# Altium schematic sheet Alim.SchDoc
size A4
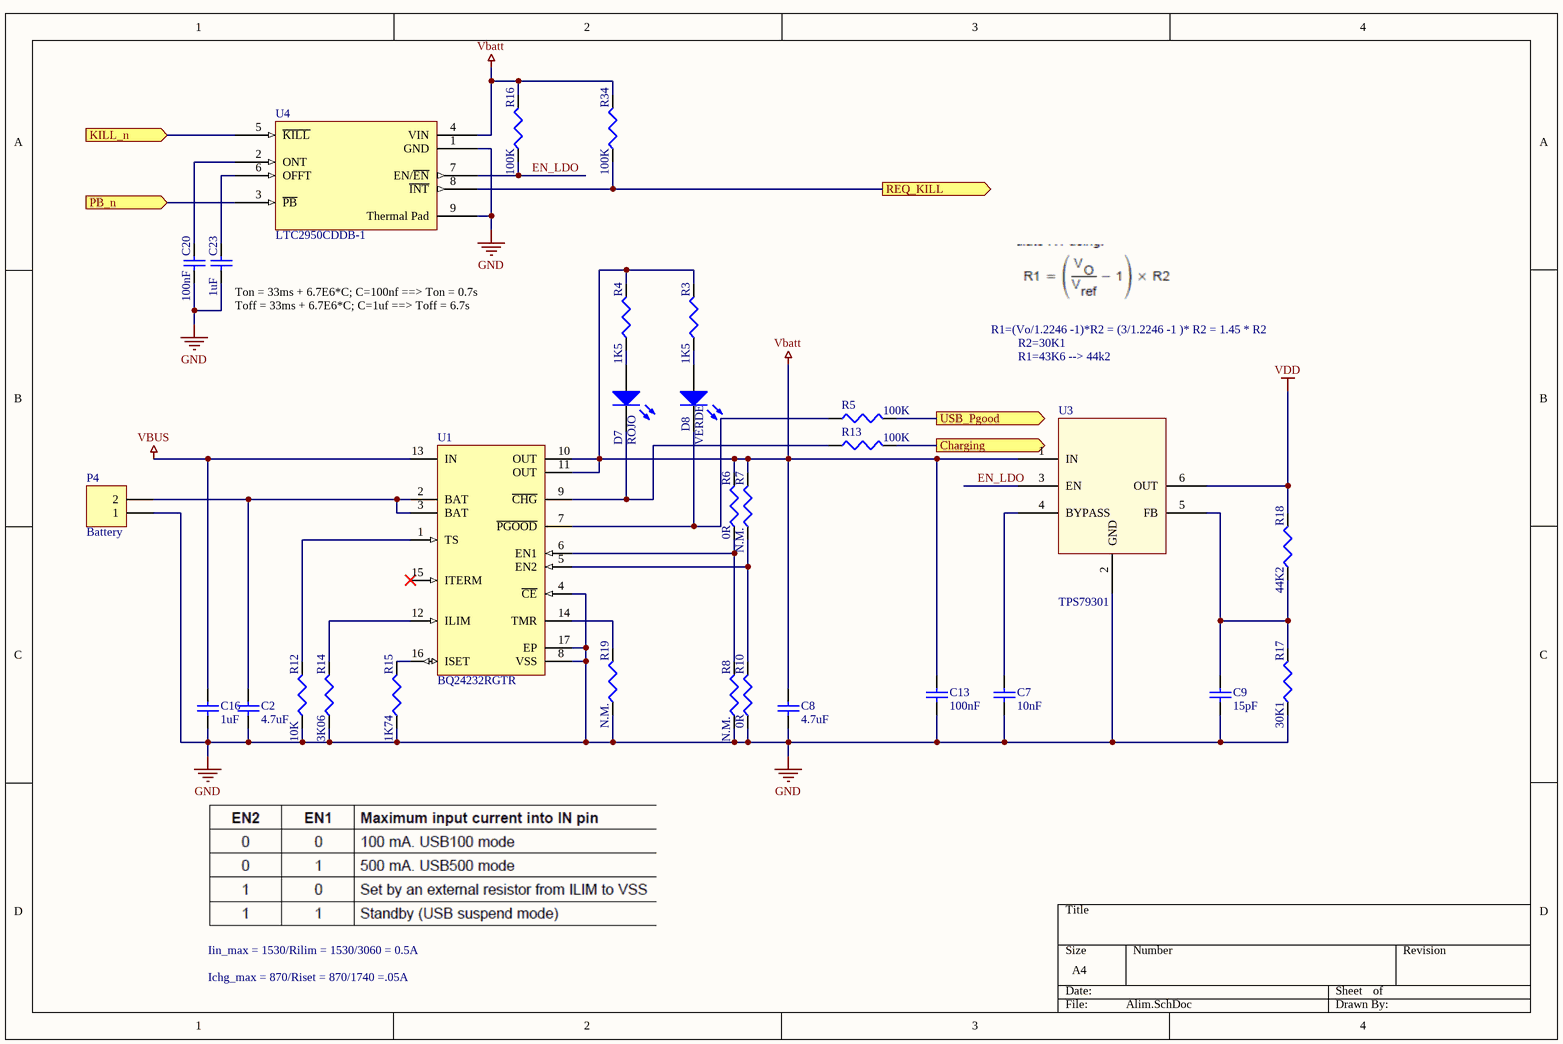
[diagram p0: Alim.SchDoc]

## Parts
C2  value 4.7uF  [C0805]  (hidden comment: Cap)
C7  value 10nF  [0402]  (hidden comment: Cap)
C8  value 4.7uF  [C0805]  (hidden comment: Cap)
C9  value 15pF  [0402]  (hidden comment: Cap)
C13  value 100nF  [0402]  (hidden comment: Cap)
C16  value 1uF  [C0805]  (hidden comment: Cap)
C20  value 100nF  [0402]  (hidden comment: Cap)
C23  value 1uF  [C0805]  (hidden comment: Cap)
D7  ROJO  [led_0805]
D8  VERDE  [led_0805]
P4  Battery  [MOLEX_5268-2]
R3  value 1K5  [J1-0603]  (hidden comment: Res3)
R4  value 1K5  [J1-0603]  (hidden comment: Res3)
R5  value 100K  [J1-0603]  (hidden comment: Res3)
R6  value 0R  [J1-0603]  (hidden comment: Res3)
R7  value N.M.  [J1-0603]  (hidden comment: Res3)
R8  value N.M.  [J1-0603]  (hidden comment: Res3)
R10  value 0R  [J1-0603]  (hidden comment: Res3)
R12  value 10K  [J1-0603]  (hidden comment: Res3)
R13  value 100K  [J1-0603]  (hidden comment: Res3)
R14  value 3K06  [J1-0603]  (hidden comment: Res3)
R15  value 1K74  [J1-0603]  (hidden comment: Res3)
R16  value 100K  [J1-0603]  (hidden comment: Res3)
R17  value 30K1  [J1-0603]  (hidden comment: Res3)
R18  value 44K2  [J1-0603]  (hidden comment: Res3)
R19  value N.M.  [J1-0603]  (hidden comment: Res3)
R34  value 100K  [J1-0603]  (hidden comment: Res3)
U1  BQ24232RGTR  [RGT16-1700X1700TP_SP]
U3  TPS79301  [SOT26A-6M]
U4  LTC2950CDDB-1  [DDB8]

## Ports
Charging (out), KILL_n (in), PB_n (in), REQ_KILL (out), USB_Pgood (out)

## Nets
GND: C2.1 C7.1 C8.1 C9.1 C13.1 C16.1 C20.1 C23.1 P4.1 R8.1 R10.1 R12.1 R14.1 R15.1 R17.1 R19.1 U1.4(~{CE}) U1.8(VSS) U1.17(EP) U3.2(GND) U4.1(GND) U4.9(Thermal_Pad)
Vbatt: C8.2 C13.2 R3.2 R4.2 R6.2 R7.2 R16.2 R34.2 U1.10(OUT) U1.11(OUT) U3.1(IN) U4.4(VIN)
VBUS: C16.2 U1.13(IN)
VDD: R18.2 U3.6(OUT)
Charging: R13.2 ; port Charging
EN_LDO: R16.1 U3.3(EN) U4.7(EN/~{EN})
KILL_n: U4.5(~{KILL}) ; port KILL_n
PB_n: U4.3(~{PB}) ; port PB_n
REQ_KILL: R34.1 U4.8(~{INT}) ; port REQ_KILL
USB_Pgood: R5.2 ; port USB_Pgood
NetC2_2: C2.2 P4.2 U1.2(BAT) U1.3(BAT)
NetC7_2: C7.2 U3.4(BYPASS)
NetC9_2: C9.2 R17.2 R18.1 U3.5(FB)
NetC20_2: C20.2 U4.2(ONT)
NetC23_2: C23.2 U4.6(OFFT)
NetD7_1: D7.1(A) R4.1
NetD7_2: D7.2(K) R13.1 U1.9(~{CHG})
NetD8_1: D8.1(A) R3.1
NetD8_2: D8.2(K) R5.1 U1.7(~{PGOOD})
NetR6_1: R6.1 R8.2 U1.6(EN1)
NetR7_1: R7.1 R10.2 U1.5(EN2)
NetR12_2: R12.2 U1.1(TS)
NetR14_2: R14.2 U1.12(ILIM)
NetR15_2: R15.2 U1.16(ISET)
NetR19_2: R19.2 U1.14(TMR)

Not connected (* = marked no-connect by the designer): U1 15(ITERM)*

## Notes on the sheet
- (near C23) Ton = 33ms + 6.7E6*C; C=100nf ==> Ton = 0.7s
  Toff = 33ms + 6.7E6*C; C=1uf ==> Toff = 6.7s
- R1=(Vo/1.2246 -1)*R2 = (3/1.2246 -1 )* R2 = 1.45 * R2
- R2=30K1
- R1=43K6 --> 44k2
- Iin_max = 1530/Rilim = 1530/3060 = 0.5A
- Ichg_max = 870/Riset = 870/1740 =.05A

## Library data of the parts
C2 C8 = Cap: Capacitor; Manufacturer: FARNELL; RS: 698-3579; Order N: 1759414; Published: 8-Jun-2000; LatestRevisionDate: 17-Jul-2002; LatestRevisionNote: Re-released for DXP Platform.; PackageReference: RAD-0.3; Publisher: Altium Limited; PackageDescription: Radial Cap, Thru-Hole; 2 Leads; 0.3 in Pin Spacing; FARNELL: 1759414
C7 = Cap: Capacitor; Manufacturer: FARNELL; RS: 624-2301; Order N: 1650807; Published: 8-Jun-2000; LatestRevisionDate: 17-Jul-2002; LatestRevisionNote: Re-released for DXP Platform.; PackageReference: RAD-0.3; Publisher: Altium Limited; PackageDescription: Radial Cap, Thru-Hole; 2 Leads; 0.3 in Pin Spacing; FARNELL: 1650807
C9 = Cap: Capacitor; Manufacturer: FARNELL; RS: 788-0266; Order N: 2218840; Published: 8-Jun-2000; LatestRevisionDate: 17-Jul-2002; LatestRevisionNote: Re-released for DXP Platform.; PackageReference: RAD-0.3; Publisher: Altium Limited; PackageDescription: Radial Cap, Thru-Hole; 2 Leads; 0.3 in Pin Spacing; FARNELL: 2218840
C13 C20 = Cap: Capacitor; Manufacturer: FARNELL; RS: 788-2843; Order N: 2309011; Published: 8-Jun-2000; LatestRevisionDate: 17-Jul-2002; LatestRevisionNote: Re-released for DXP Platform.; PackageReference: RAD-0.3; Publisher: Altium Limited; PackageDescription: Radial Cap, Thru-Hole; 2 Leads; 0.3 in Pin Spacing; FARNELL: 2309011
C16 C23 = Cap: Capacitor; Manufacturer: FARNELL; RS: 653-0490; Order N: 2320857; Published: 8-Jun-2000; LatestRevisionDate: 17-Jul-2002; LatestRevisionNote: Re-released for DXP Platform.; PackageReference: RAD-0.3; Publisher: Altium Limited; PackageDescription: Radial Cap, Thru-Hole; 2 Leads; 0.3 in Pin Spacing; FARNELL: 2320857
D7 = LED2: Typical RED, GREEN, YELLOW, AMBER GaAs LED; Manufacturer: Smart Prototyping; SP: SP-C2286; FARNELL: 2099236; Value: Rojo; Order N: SP-C2286
D8 = LED2: Typical RED, GREEN, YELLOW, AMBER GaAs LED; Manufacturer: Smart Prototyping; SP: SP-C2292; FARNELL: 2290331; Value: Verde; Order N: SP-C2292
P4 = Header 2: Header, 2-Pin; Manufacturer: FARNELL; Order N: 9979611; LatestRevisionDate: 17-Jul-2002; LatestRevisionNote: Re-released for DXP Platform.; Publisher: Altium Limited; FARNELL: 9979611
R3 R4 = Res3: Resistor; Manufacturer: FARNELL; RS: N.E.; Order N: 2331729; Published: 8-Jun-2000; LatestRevisionDate: 29-May-2009; LatestRevisionNote: IPC-7351 Footprint Added.; PackageReference: J1-0603; Publisher: Altium Limited; PackageDescription: Chip Resistor; FARNELL: 2331729
R5 R13 R16 R34 = Res3: Resistor; Manufacturer: FARNELL; RS: N.E.; Order N: 2331753; Published: 8-Jun-2000; LatestRevisionDate: 29-May-2009; LatestRevisionNote: IPC-7351 Footprint Added.; PackageReference: J1-0603; Publisher: Altium Limited; PackageDescription: Chip Resistor; FARNELL: 2331753
R6 R10 = Res3: Resistor; Manufacturer: FARNELL; RS: 740-8870; Order N: 2309106; Published: 8-Jun-2000; LatestRevisionDate: 29-May-2009; LatestRevisionNote: IPC-7351 Footprint Added.; PackageReference: J1-0603; Publisher: Altium Limited; PackageDescription: Chip Resistor; FARNELL: 2309106
R7 R8 R19 = Res3: Resistor; Published: 8-Jun-2000; LatestRevisionDate: 29-May-2009; LatestRevisionNote: IPC-7351 Footprint Added.; PackageReference: J1-0603; Publisher: Altium Limited; PackageDescription: Chip Resistor
R12 = Res3: Resistor; Manufacturer: FARNELL; RS: N.E.; Order N: 2333520; Published: 8-Jun-2000; LatestRevisionDate: 29-May-2009; LatestRevisionNote: IPC-7351 Footprint Added.; PackageReference: J1-0603; Publisher: Altium Limited; PackageDescription: Chip Resistor; FARNELL: 2333520
R14 = Res3: Resistor; Manufacturer: FARNELL; RS: N.E.; Order N: 1527525; Published: 8-Jun-2000; LatestRevisionDate: 29-May-2009; LatestRevisionNote: IPC-7351 Footprint Added.; PackageReference: J1-0603; Publisher: Altium Limited; PackageDescription: Chip Resistor; FARNELL: 1527525
R15 = Res3: Resistor; Manufacturer: FARNELL; RS: N.E.; Order N: 2116703; Published: 8-Jun-2000; LatestRevisionDate: 29-May-2009; LatestRevisionNote: IPC-7351 Footprint Added.; PackageReference: J1-0603; Publisher: Altium Limited; PackageDescription: Chip Resistor; FARNELL: 2116703
R17 = Res3: Resistor; Manufacturer: FARNELL; RS: N.E.; Order N: 1527635; Published: 8-Jun-2000; LatestRevisionDate: 29-May-2009; LatestRevisionNote: IPC-7351 Footprint Added.; PackageReference: J1-0603; Publisher: Altium Limited; PackageDescription: Chip Resistor; FARNELL: 1527635
R18 = Res3: Resistor; Manufacturer: FARNELL; RS: N.E.; Order N: 1785891; Published: 8-Jun-2000; LatestRevisionDate: 29-May-2009; LatestRevisionNote: IPC-7351 Footprint Added.; PackageReference: J1-0603; Publisher: Altium Limited; PackageDescription: Chip Resistor; FARNELL: 1785891
U1 = BQ24232RGTR: USB Friendly 0.5 A Li+ Charger with Dynamic Power Management, 10.5 V OVP, 4.3 V, -40 to 85 degC, 16-pin QFN (RGT), Green (RoHS & no Sb/Br); Manufacturer: FARNELL; RS: N.E.; PN: BQ24232RGTT; Order N: 2383064; PackageReference: RGT16-1700X1700TP; PackageDescription: 16-Pin Plastic Quad Flat No-Lead, 3 x 3 mm Body, 0.5 mm Pitch, 1.7 x 1.7 mm Exposed Pad; FARNELL: 2383064
U3 = TPS79301: Manufacturer: FARNELL; RS: 661-4478; PN: TPS79301DBVR; Order N: 1460960; FARNELL: 1460960
U4 = LTC2950CDDB-1: Push Button On/Off Controller; Manufacturer: FARNELL; Note: 1915; Order N: 1673537; Published: 30-May-2008; DatasheetVersion: Feb-2008; PackageVersion: Rev B, Sep-2005; PackageReference: DDB8; Publisher: Altium Limited; PackageDescription: 8-Pin Plastic DFN, 3 x 2 x 0.8 mm Body, 0.5 mm Pitch, No Pullback, Exposed Pad (DDB8); Code_JEDEC: MO-229-WECD-1; ComponentLink1Description: Manufacturer Link; ComponentLink1URL: http://www.linear.com/; ComponentLink2Description: Datasheet; ComponentLink2URL: http://www.linear.com/pc/downloadDocument.do?navId=H0,C1,C1003,C1144,C1783,P10330,D7377; FARNELL: 1673537; PN: LTC2950CDDB-1